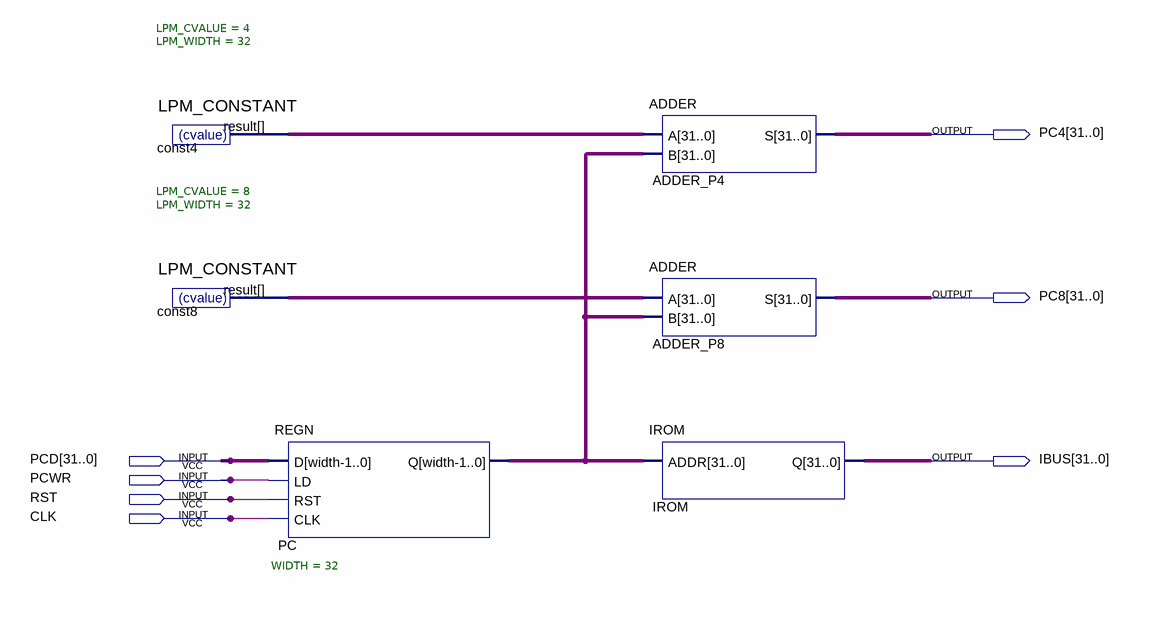
[diagram p0: schematic sheet]
// Quartus schematic fetch.bdf as structural Verilog: 6 symbols, 7 pins
module fetch (
  input  [31:0] PCD,
  input  PCWR,
  input  RST,
  input  CLK,
  output [31:0] PC4,
  output [31:0] PC8,
  output [31:0] IBUS
);

  wire [31:0] const4_result, const8_result, PC_q;

  LPM_CONSTANT #(.LPM_CVALUE(4), .LPM_WIDTH(32)) const4 (.result(const4_result));
  LPM_CONSTANT #(.LPM_CVALUE(8), .LPM_WIDTH(32)) const8 (.result(const8_result));
  REGN #(.WIDTH(32)) PC (.D(PCD), .LD(PCWR), .RST(RST), .CLK(CLK), .Q(PC_q));
  ADDER ADDER_P4 (.A(const4_result), .B(PC_q), .S(PC4));
  ADDER ADDER_P8 (.A(const8_result), .B(PC_q), .S(PC8));
  IROM IROM (.ADDR(PC_q), .Q(IBUS));
endmodule
